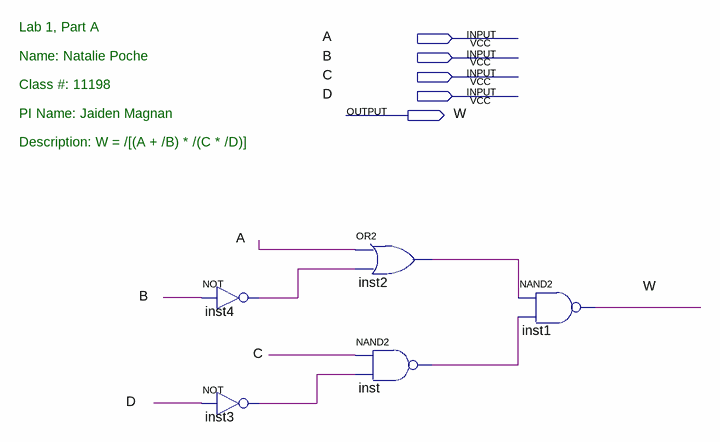
[diagram p0: schematic sheet]
// Quartus schematic Lab1a.bdf as structural Verilog: 5 symbols, 5 pins
module Lab1a (
  input  A,
  input  B,
  input  C,
  input  D,
  output W
);

  wire inst2_out, inst3_out, inst4_out, inst_out;

  not inst4 (inst4_out, B);
  not inst3 (inst3_out, D);
  or inst2 (inst2_out, A, inst4_out);
  nand inst (inst_out, C, inst3_out);
  nand inst1 (W, inst2_out, inst_out);

  // Notes on the sheet:
  //   Lab 1, Part A
  //   Name: Natalie Poche
  //   Class #: 11198
  //   PI Name: Jaiden Magnan
  //   Description: W = /[(A + /B) * /(C * /D)]
endmodule
